# EAGLE design tilt_soms_lgbu (EAGLE 9.0.1)
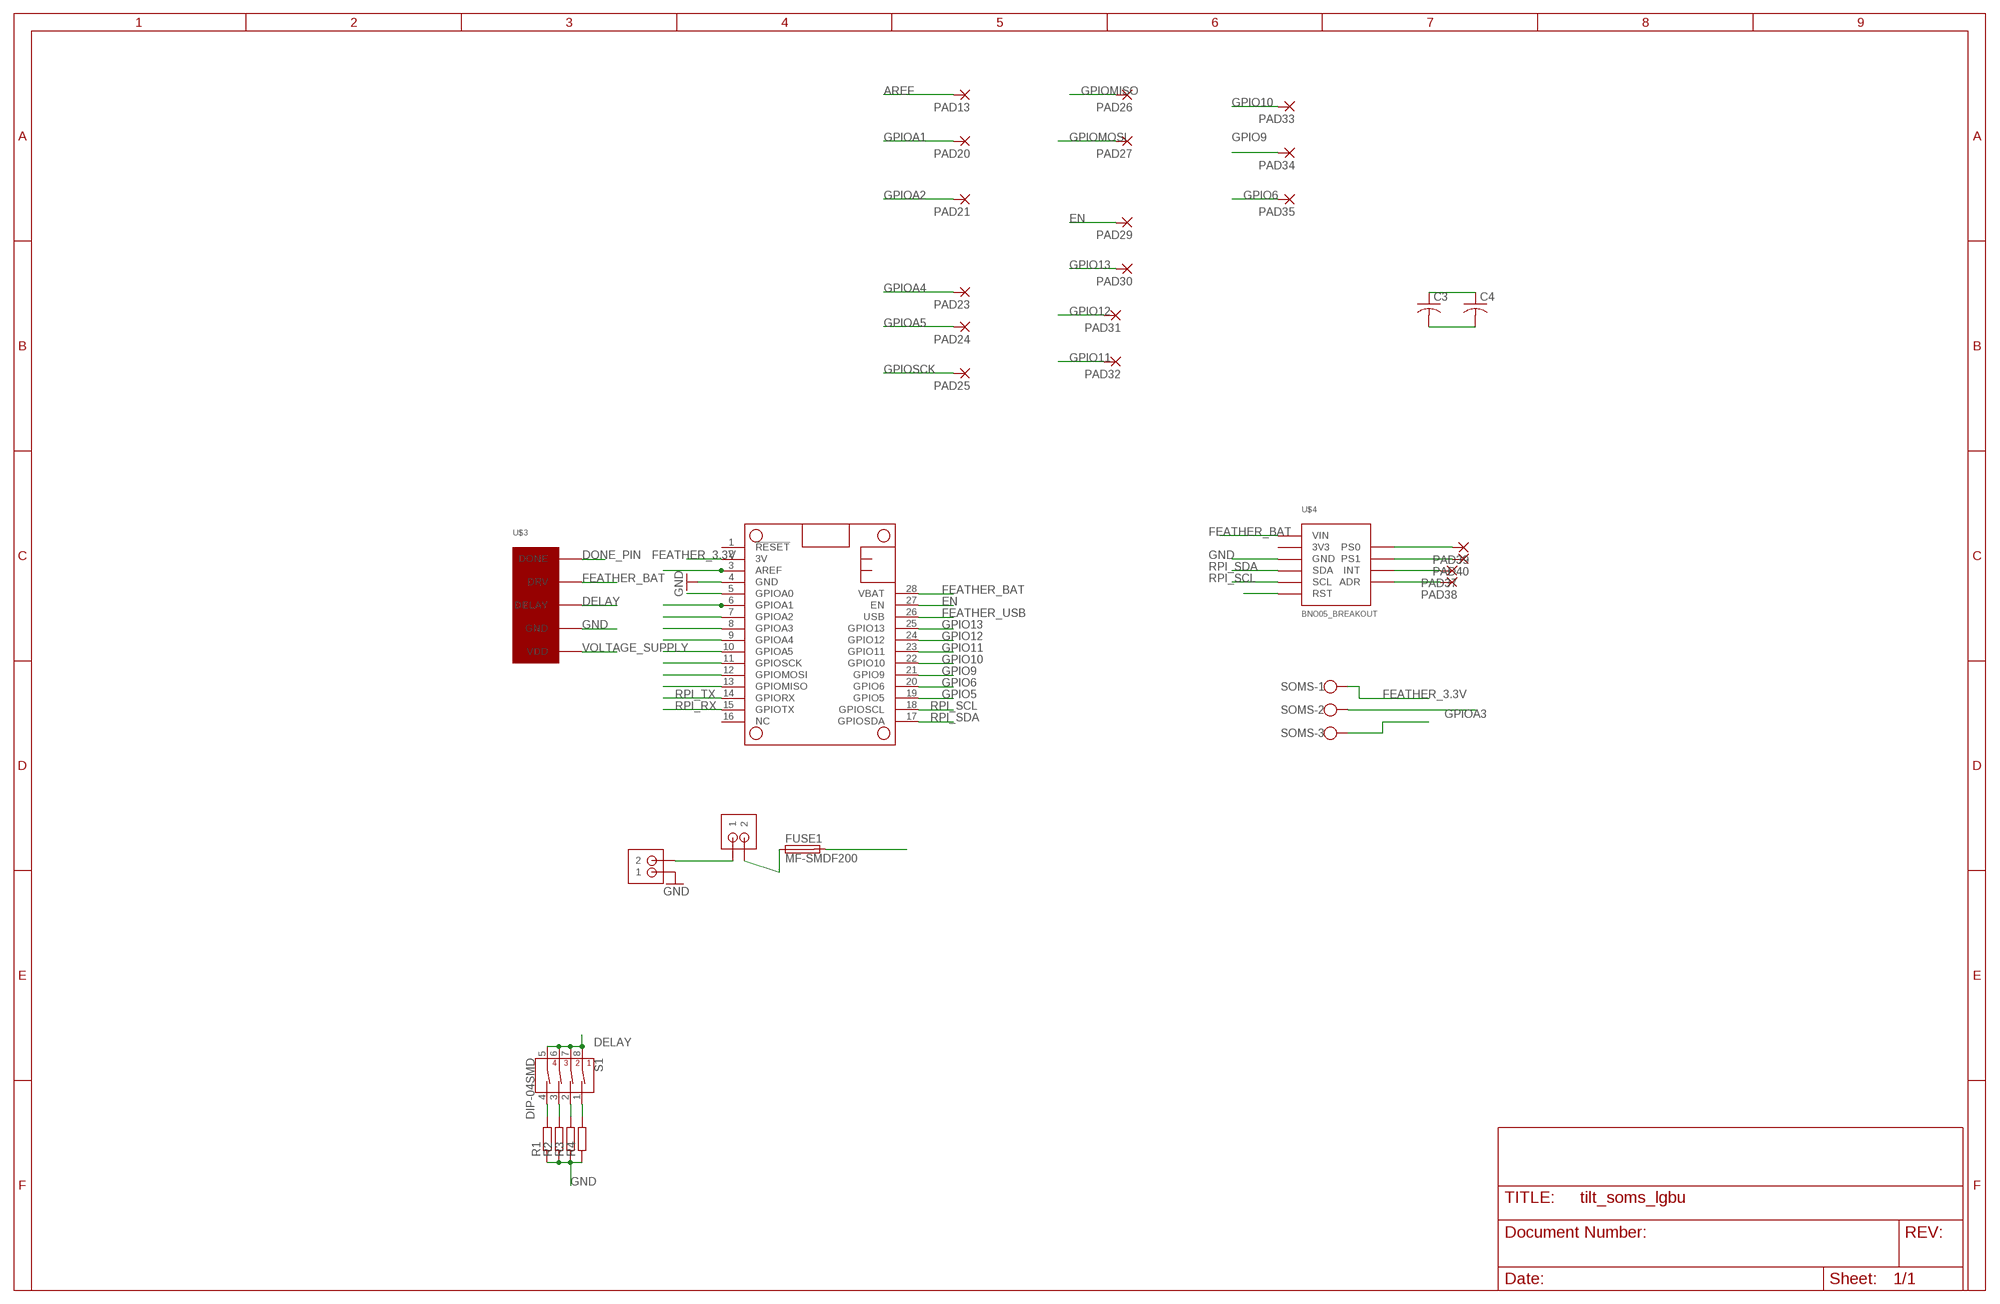
[diagram p0: schematic, sheet 1]

## Parts
BATT  JST-PH_2-PIN_HEADER  [JST_B2B-PH_HEADER]
C3  C-USC1812  [C1812]
C4  C-USC1812  [C1812]
FUSE1  MF-SMDF200  [MF-SMDF050]
MAIN_SWITCH  JST-PH_2-PIN_HEADER  [JST_B2B-PH_HEADER]
MS1  FEATHERWING_NODIM  [FEATHERWING_DIM]
PAD13  WIREPADSMD1,27-254  [SMD1,27-2,54]
PAD20  WIREPADSMD1,27-254  [SMD1,27-2,54]
PAD21  WIREPADSMD1,27-254  [SMD1,27-2,54]
PAD23  WIREPADSMD1,27-254  [SMD1,27-2,54]
PAD24  WIREPADSMD1,27-254  [SMD1,27-2,54]
PAD25  WIREPADSMD1,27-254  [SMD1,27-2,54]
PAD26  WIREPADSMD1,27-254  [SMD1,27-2,54]
PAD27  WIREPADSMD1,27-254  [SMD1,27-2,54]
PAD29  WIREPADSMD1,27-254  [SMD1,27-2,54]
PAD30  WIREPADSMD1,27-254  [SMD1,27-2,54]
PAD31  WIREPADSMD1,27-254  [SMD1,27-2,54]
PAD32  WIREPADSMD1,27-254  [SMD1,27-2,54]
PAD33  WIREPADSMD1,27-254  [SMD1,27-2,54]
PAD34  WIREPADSMD1,27-254  [SMD1,27-2,54]
PAD35  WIREPADSMD1,27-254  [SMD1,27-2,54]
PAD37  WIREPADSMD1,27-254  [SMD1,27-2,54]
PAD38  WIREPADSMD1,27-254  [SMD1,27-2,54]
PAD39  WIREPADSMD1,27-254  [SMD1,27-2,54]
PAD40  WIREPADSMD1,27-254  [SMD1,27-2,54]
R1  R-EU_0204/5  [0204/5]
R2  R-EU_0204/5  [0204/5]
R3  R-EU_0204/5  [0204/5]
R4  R-EU_0204/5  [0204/5]
S1  DIP-04SMD  [DIPSWITCH-04-SMD]
SOMS  W237-103  [W237-103]
U$3  TPL5110_BREAKOUT  [TPL5110_BREAKOUT]
U$4  BNO05_BREAKOUT  [BNO05_BREAKOUT]

## Nets
AREF: MS1.3(AREF) PAD13.1(P)
DELAY: S1.5(4B) S1.6(3B) S1.7(2B) S1.8(1B) U$3.DELAY
DONE_PIN: MS1.5(GPIOA0) U$3.DONE
EN: MS1.27(EN) PAD29.1(P)
FEATHER_3.3V: MS1.2(3V) SOMS.1
FEATHER_BAT: MS1.28(VBAT) U$3.DRV U$4.VIN
FEATHER_USB: MS1.26(USB)
GND: BATT.P1 C3.2 C4.2 MS1.4(GND) R1.1 R2.1 R3.1 R4.1 SOMS.3 U$3.GND U$4.GND
GPIO5: MS1.19(GPIO5) U$4.RST
GPIO6: MS1.20(GPIO6) PAD35.1(P)
GPIO9: MS1.21(GPIO9) PAD34.1(P)
GPIO10: MS1.22(GPIO10) PAD33.1(P)
GPIO11: MS1.23(GPIO11) PAD32.1(P)
GPIO12: MS1.24(GPIO12) PAD31.1(P)
GPIO13: MS1.25(GPIO13) PAD30.1(P)
GPIOA1: MS1.6(GPIOA1) PAD20.1(P)
GPIOA2: MS1.7(GPIOA2) PAD21.1(P)
GPIOA3: MS1.8(GPIOA3) SOMS.2
GPIOA4: MS1.9(GPIOA4) PAD23.1(P)
GPIOA5: MS1.10(GPIOA5) PAD24.1(P)
GPIOMISO: MS1.13(GPIOMISO) PAD26.1(P)
GPIOMOSI: MS1.12(GPIOMOSI) PAD27.1(P)
GPIOSCK: MS1.11(GPIOSCK) PAD25.1(P)
N$1: PAD37.1(P) U$4.INT
N$3: BATT.P2 MAIN_SWITCH.P1
N$4: FUSE1.1 MAIN_SWITCH.P2
N$5: PAD38.1(P) U$4.ADR
N$6: PAD39.1(P) U$4.PS0
N$7: PAD40.1(P) U$4.PS1
N$9: R1.2 S1.4(4A)
N$10: R2.2 S1.3(3A)
N$11: R3.2 S1.2(2A)
N$12: R4.2 S1.1(1A)
RPI_RX: MS1.15(GPIOTX)
RPI_SCL: MS1.18(GPIOSCL) U$4.SCL
RPI_SDA: MS1.17(GPIOSDA) U$4.SDA
RPI_TX: MS1.14(GPIORX)
VOLTAGE_SUPPLY: C3.1 C4.1 FUSE1.2 U$3.VDD
Unconnected: MS1.1(!RESET) MS1.16(NC) U$4.3V3

## Library data of the parts
BATT MAIN_SWITCH = SRG:JST-PH_2-PIN_HEADER: 2-pin JST PH Shrouded Header, top entry P/N B2B-PH-K-S Mating connector PHR-2 Mating cable assembly: Sparkfun PRT-09914 <http://www.sparkfun.com/products/9914>
C3 C4 = rcl:C-US: CAPACITOR, American symbol
FUSE1 = fuse:MF-SMDF: MF-SMDF Series - PRC Resettable Fuses Source: http://www.farnell.com/datasheets/716597.pdf
MS1 = adafruit:FEATHERWING
PAD13 PAD20 PAD21 PAD23-PAD27 PAD29-PAD35 PAD37-PAD40 = wirepad:WIREPAD: Wire PAD connect wire on PCB
R1-R4 = rcl:R-EU_: RESISTOR, European symbol
S1 = SparkFun-Switches:DIP-04: 4-Position DIP Switch 4-circuit DIP (dual inline package) switch. Commonly used to physcially set a circuit's behavior. SparkFun Products Prototype Part; PROD_ID: SWCH-12418
SOMS = con-wago-500:W237-103: WAGO SCREW CLAMP; MPN: 237-103; OC_FARNELL: unknown; OC_NEWARK: 18M7116
U$3 = edc_modules:TPL5110_BREAKOUT
U$4 = edc_modules:BNO05_BREAKOUT

## Board
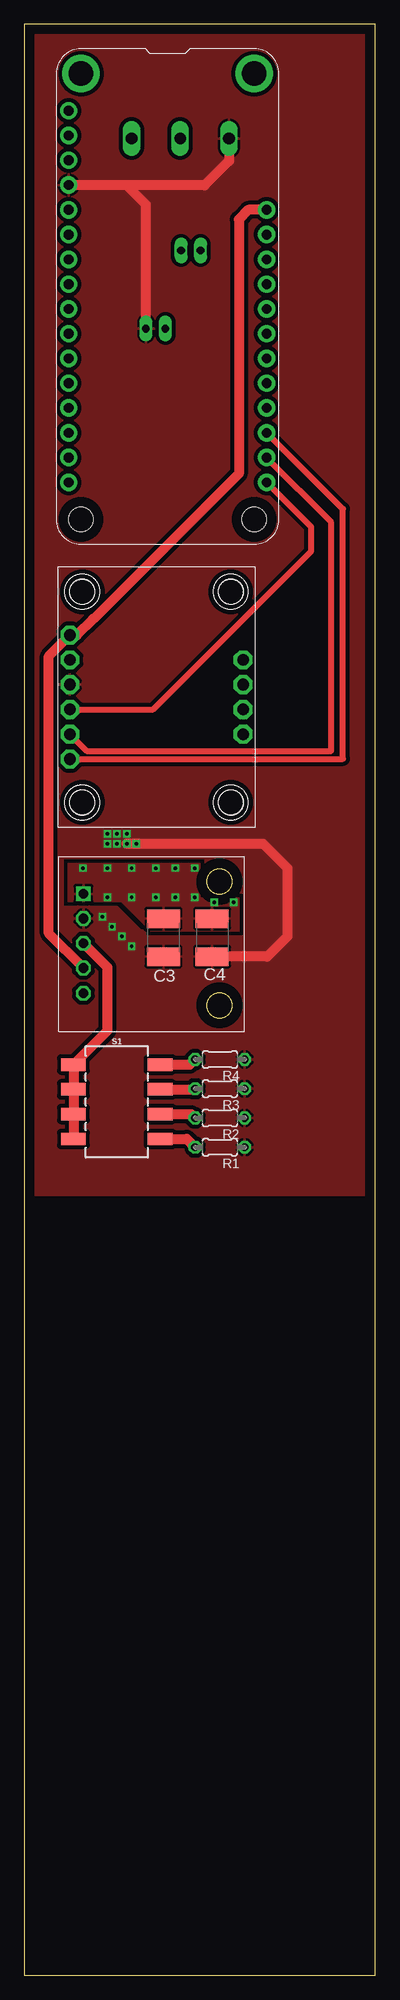
[diagram p1: board, top side]
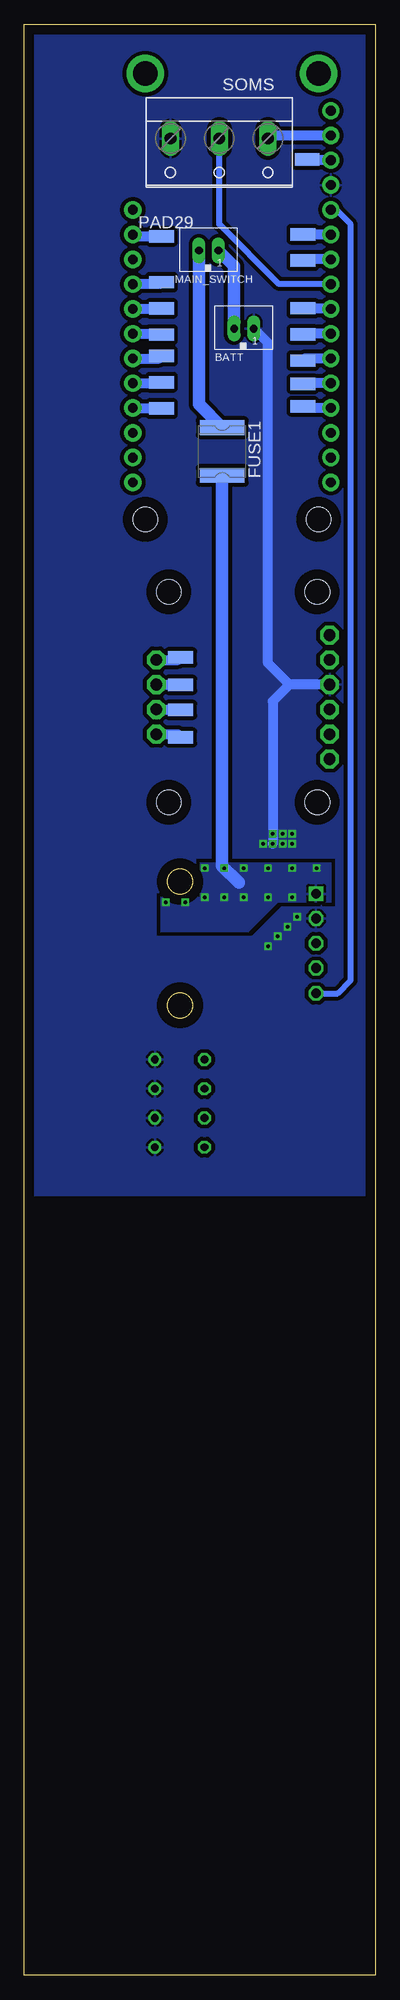
[diagram p2: board, bottom side, seen from below]

Size 36 x 200 mm. Coordinates in mm from the lower left corner, seen from the top.
Outline: 0,0 36,0 36,200 0,200 0,0
Copper layers (1*16): Top 0.035mm / dielectric 1.5mm / Bottom 0.035mm
Design rules "default": minimum track width 6mil, minimum drill 0.35mm, track to track 6mil, track to pad 6mil, pad to pad 6mil, via to via 6mil, smd to smd 6mil, copper to edge 40mil, drill to drill 6mil, minimum pad ring 10mil, minimum via ring 8mil, stop-mask expansion 4mil, vias tented up to drill 0mil, thermal gap 10mil

### Footprints (pad centres in the part's own frame; a part is rotated, then mirrored left to right if it is on the bottom)
JST_B2B-PH_HEADER = drill 0.8 long: P1 1.075,0.048; P2 -0.925,0.048
C1812 = smd 1.9 x 3.4: 1 -1.95,0; 2 1.95,0
MF-SMDF050 = smd 1.5 x 4.6: 1 -2.45,0; 2 2.45,0
FEATHERWING_DIM = drill 1 pad 1.778: 1 6.35,1.27; 2 8.89,1.27; 3 11.43,1.27; 4 13.97,1.27; 5 16.51,1.27; 6 19.05,1.27; 7 21.59,1.27; 8 24.13,1.27; 9 26.67,1.27; 10 29.21,1.27; 11 31.75,1.27; 12 34.29,1.27; 13 36.83,1.27; 14 39.37,1.27; 15 41.91,1.27; 16 44.45,1.27; 17 44.45,21.59; 18 41.91,21.59; 19 39.37,21.59; 20 36.83,21.59; 21 34.29,21.59; 22 31.75,21.59; 23 29.21,21.59; 24 26.67,21.59; 25 24.13,21.59; 26 21.59,21.59; 27 19.05,21.59; 28 16.51,21.59 | drill 2.5 pad 3.81: P$1 2.54,20.32; P$2 2.54,2.54 | hole 2.54: 48.26,20.32; 48.26,2.54
SMD1,27-2,54 = smd 1.27 x 2.54: 1 0,0
0204/5 = drill 0.813 octagon: 1 -2.54,0; 2 2.54,0
DIPSWITCH-04-SMD = smd 1.27 x 2.54: 1 -3.81,4.445; 2 -1.27,4.445; 3 1.27,4.445; 4 3.81,4.445; 5 3.81,-4.445; 6 1.27,-4.445; 7 -1.27,-4.445; 8 -3.81,-4.445
W237-103 = drill 1.194 long: 1 -5,-1.29; 2 0,-1.29; 3 5,-1.29
TPL5110_BREAKOUT = drill 1 octagon: DELAY 7.366,2.159; DONE 12.496,2.159; DRV 9.906,2.159; GND 4.826,2.159 | drill 1 square: VDD 2.286,2.159
BNO05_BREAKOUT = drill 1.2 pad 1.93 octagon: 3V3 9.525,1.27; ADR 17.145,19.05; GND 12.065,1.27; INT 14.605,19.05; PS0 9.525,19.05; PS1 12.065,19.05; RST 19.685,1.27; SCL 17.145,1.27; SDA 14.605,1.27; VIN 6.985,1.27 | hole 2.54: 2.54,17.78; 2.54,2.54; 24.13,2.54; 24.13,17.78

### Placement (x,y rotation side)
BATT  13.54,168.77 0 bottom
C3  14.27,106.37 270 top
C4  19.27,106.37 270 top
FUSE1  15.7,156.21 270 bottom
MAIN_SWITCH  17.16,176.77 0 bottom
MS1  3.27,197.5 270 top
PAD13  6.97,186.15 90 bottom
PAD20  7.42,178.47 270 bottom
PAD21  7.42,175.78 270 bottom
PAD23  7.42,170.9 270 bottom
PAD24  7.42,168.21 270 bottom
PAD25  7.42,165.52 270 bottom
PAD26  7.42,160.83 270 bottom
PAD27  7.42,163.14 270 bottom
PAD29  21.92,178.26 270 bottom
PAD30  21.92,173.57 270 bottom
PAD31  21.92,170.88 270 bottom
PAD32  21.92,168.19 270 bottom
PAD33  21.92,166 270 bottom
PAD34  21.92,163.31 270 bottom
PAD35  21.92,160.62 270 bottom
PAD37  19.96,129.72 90 bottom
PAD38  19.96,126.91 90 bottom
PAD39  19.96,135.1 90 bottom
PAD40  19.96,132.29 90 bottom
R1  20.07,84.88 180 top
R2  20.07,87.88 180 top
R3  20.07,90.88 180 top
R4  20.07,93.88 180 top
S1  9.48,89.54 270 top
SOMS  16,187 180 bottom
U$3  3.9,113.15 270 top
U$4  3.4,144.37 270 top

### Tracks (layer width: path | path; a pad name or v marks a point on that pad's centre or on a via)
AREF
  Bottom 1.016: MS1.3 7.39,186.07 PAD13.1
DELAY
  Top 1.016: S1.5 S1.6 S1.7 S1.8 8.5,96.81 8.5,103.34 U$3.DELAY
DONE_PIN
  Bottom 0.61: U$3.DONE 3.85,100.65 2.5,102 2.5,179.5 4,181 4.01,180.99 MS1.5
EN
  Bottom 1.016: MS1.27 24.67,178.26 PAD29.1
FEATHER_3.3V
  Bottom 1.016: MS1.2 10.68,188.61 SOMS.1
FEATHER_BAT
  Top 1.016: U$3.DRV 2.5,106.8 2.5,135.22 U$4.VIN 5.38,137.38 7.04,139.04 7.1,139.04 22,153.94 22,180 22.99,180.99 MS1.28
GND  (via drill 0.35)
  Top 1.016: SOMS.3 21,186 18.5,183.5 10.5,183.5 | 10.5,183.5 4.57,183.5 MS1.4 | BATT.P1 12.46,181.53 10.5,183.5 | v10.5,116 24.5,116 27,113.5 27,106.5 24.92,104.42 C4.2
  Bottom 1.016: U$4.GND 8.8,132.31 | 8.8,132.31 11,134.5 11,167.35 BATT.P1 | 8.8,132.31 10.5,130.61 v10.5,116
  other vias: 8,108.5 9,107.5 10,106.5 11,105.5 11.5,116 10.5,117 9.5,116 8.5,116 9.5,117 8.5,117
  pour Bottom (isolate 0.254): 4.5,109.5 4.5,107.5 7.5,107.5 12,103 21.5,103 22,103 22,106 21.5,106 12,106 8.5,109.5
  pour Top (isolate 0.254, rank 3): 4.5,109.5 4.5,107.5 7.5,107.5 12,103 22,103 22,106 12,106 8.5,109.5
  pour Bottom (isolate 0.254, rank 3): 4,133 12,133 13,132 13,116 12.5,115.5 9.5,115.5 9,116 9,131 8.5,131.5 4,131.5
  pour Bottom (isolate 0.406, rank 6): 0,80 36,80 36,200 32.5,200 0,200
  pour Top (isolate 0.406, rank 6): 0,80 36,80 36,200 0,200
GPIO5
  Top 0.61: U$4.RST 32.69,124.69 32.69,150.31 MS1.19
GPIO6
  Bottom 1.016: MS1.20 21.97,160.67 PAD35.1
GPIO9
  Bottom 1.016: MS1.21 22.02,163.21 PAD34.1
GPIO10
  Bottom 1.016: MS1.22 22.17,165.75 PAD33.1
GPIO11
  Bottom 1.016: MS1.23 22.02,168.29 PAD32.1
GPIO12
  Bottom 1.016: MS1.24 21.97,170.83 PAD31.1
GPIO13
  Bottom 1.016: PAD30.1 22.12,173.37 MS1.25
GPIOA1
  Bottom 1.016: MS1.6 7.4,178.45 PAD20.1
GPIOA2
  Bottom 1.016: MS1.7 7.29,175.91 PAD21.1
GPIOA3
  Bottom 0.61: MS1.8 9.87,173.37 16,179.5 SOMS.2
GPIOA4
  Bottom 1.016: MS1.9 7.35,170.83 PAD23.1
GPIOA5
  Bottom 1.016: MS1.10 7.34,168.29 PAD24.1
GPIOMISO
  Bottom 1.016: MS1.13 7.26,160.67 PAD26.1
GPIOMOSI
  Bottom 1.016: MS1.12 7.35,163.21 PAD27.1
GPIOSCK
  Bottom 1.016: MS1.11 7.19,165.75 PAD25.1
N$1
  Bottom 1.016: U$4.INT 20,129.76 PAD37.1
N$3
  Bottom 1.27: BATT.P2 14.46,175.2 MAIN_SWITCH.P1
N$4
  Bottom 1.27: MAIN_SWITCH.P2 18.09,161.04 FUSE1.1
N$5
  Bottom 1.016: U$4.ADR 20.27,127.22 PAD38.1
N$6
  Bottom 1.016: U$4.PS0 20.21,134.84 PAD39.1
N$7
  Bottom 1.016: U$4.PS1 19.98,132.31 PAD40.1
N$9
  Top 1.016: S1.4 16.68,85.73 R1.2
N$10
  Top 1.016: S1.3 17.14,88.27 R2.2
N$11
  Top 1.016: S1.2 17.46,90.81 R3.2
N$12
  Top 1.016: S1.1 17,93.35 R4.2
RPI_SCL
  Top 0.61: U$4.SCL 6.39,125.5 31.5,125.5 31.5,148.95 MS1.18
RPI_SDA
  Top 0.61: U$4.SDA 13.2,129.76 29.45,146.01 29.45,148.46 MS1.17
VOLTAGE_SUPPLY  (via drill 0.35)
  Bottom 1.27: FUSE1.2 15.7,113.7 14,112
  other vias: 8.5,110.5 11,110.5 13.5,110.5 15.5,110.5 17.5,110.5 19.5,110 21.5,110 17.5,113.5 15.5,113.5 13.5,113.5 11,113.5 8.5,113.5 6,113.5
  pour Top (isolate 0.254): 4.5,114 18,114 18,110.5 22,110.5 22,107 13,107 10,110 4.5,110
  pour Bottom (isolate 0.254, rank 3): 4.5,114 18,114 18,110.5 22,110.5 22,107 13,107 10,110 4.5,110